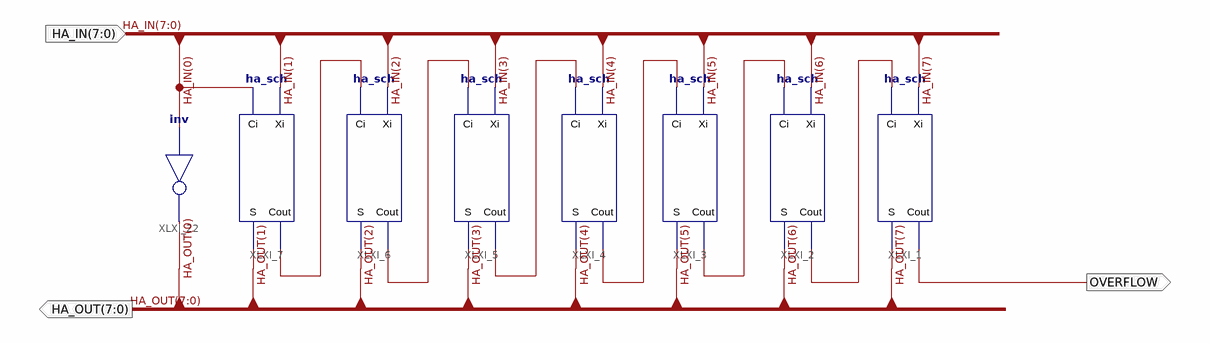
[diagram p0: schematic sheet 1]
// Xilinx ISE schematic ha8_sch.sch (spartan3e) as structural Verilog: 8 symbols, 3 ports
module ha8_sch (
  input  [7:0] HA_IN,
  output [7:0] HA_OUT,
  output OVERFLOW
);

  wire XLXN_28, XLXN_29, XLXN_30, XLXN_31, XLXN_32, XLXN_33;

  ha_sch XLXI_1 (.Xi(HA_IN[7]), .Ci(XLXN_28), .Cout(OVERFLOW), .S(HA_OUT[7]));
  ha_sch XLXI_2 (.Xi(HA_IN[6]), .Ci(XLXN_29), .Cout(XLXN_28), .S(HA_OUT[6]));
  ha_sch XLXI_3 (.Xi(HA_IN[5]), .Ci(XLXN_30), .Cout(XLXN_29), .S(HA_OUT[5]));
  ha_sch XLXI_4 (.Xi(HA_IN[4]), .Ci(XLXN_31), .Cout(XLXN_30), .S(HA_OUT[4]));
  ha_sch XLXI_5 (.Xi(HA_IN[3]), .Ci(XLXN_32), .Cout(XLXN_31), .S(HA_OUT[3]));
  ha_sch XLXI_6 (.Xi(HA_IN[2]), .Ci(XLXN_33), .Cout(XLXN_32), .S(HA_OUT[2]));
  ha_sch XLXI_7 (.Xi(HA_IN[1]), .Ci(HA_IN[0]), .Cout(XLXN_33), .S(HA_OUT[1]));
  not XLXI_22 (HA_OUT[0], HA_IN[0]);
endmodule
